# EAGLE schematic packmonitor (EAGLE 7.3.0)
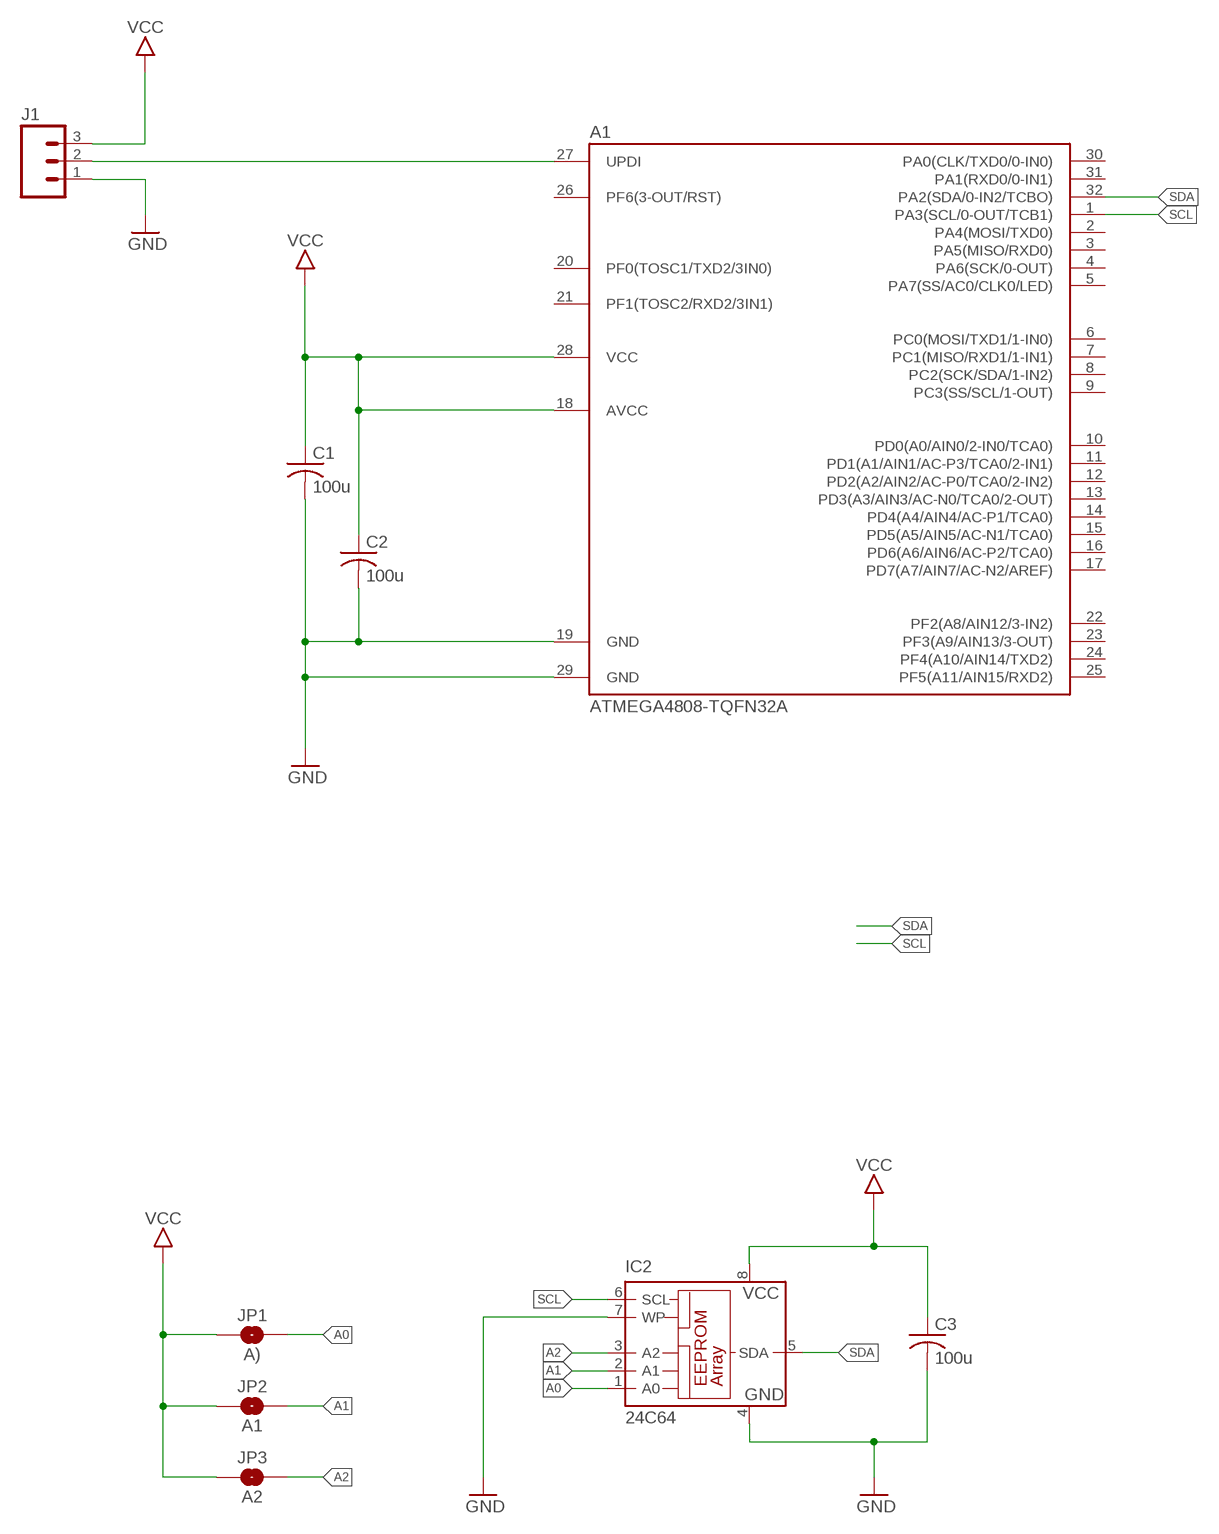
[diagram p0: schematic, sheet 1]

## Parts
A1  ATMEGA4808-TQFN32A  [TQFP32-08]
C1  100u  C-USC0603  [C0603]
C2  100u  C-USC0603  [C0603]
C3  100u  C-USC0603  [C0603]
IC2  24C64  24C04CSN  [SO-08]
J1  M03LOCK_LONGPADS  [1X03_LOCK_LONGPADS]
JP1  A)  JUMPER-SMT_2_NO_SILK  [SMT-JUMPER_2_NO_SILK]
JP2  A1  JUMPER-SMT_2_NO_SILK  [SMT-JUMPER_2_NO_SILK]
JP3  A2  JUMPER-SMT_2_NO_SILK  [SMT-JUMPER_2_NO_SILK]

## Nets
A0: IC2.1(A0) JP1.2
A1: IC2.2(A1) JP2.2
A2: IC2.3(A2) JP3.2
GND: A1.19(GND) A1.29(GND) C1.2 C2.2 C3.2 IC2.4(GND) IC2.7(WP) J1.1
N$2: A1.27(UPDI) J1.2
SCL: A1.1(PA3(SCL/0-OUT/TCB1)) IC2.6(SCL)
SDA: A1.32(PA2(SDA/0-IN2/TCBO)) IC2.5(SDA)
VCC: A1.18(AVCC) A1.28(VCC) C1.1 C2.1 C3.1 IC2.8(VCC) J1.3 JP1.1 JP2.1 JP3.1
Unconnected: A1.2(PA4(MOSI/TXD0)) A1.3(PA5(MISO/RXD0)) A1.4(PA6(SCK/0-OUT)) A1.5(PA7(SS/AC0/CLK0/LED)) A1.6(PC0(MOSI/TXD1/1-IN0)) A1.7(PC1(MISO/RXD1/1-IN1)) A1.8(PC2(SCK/SDA/1-IN2)) A1.9(PC3(SS/SCL/1-OUT)) A1.10(PD0(A0/AIN0/2-IN0/TCA0)) A1.11(PD1(A1/AIN1/AC-P3/TCA0/2-IN1)) A1.12(PD2(A2/AIN2/AC-P0/TCA0/2-IN2)) A1.13(PD3(A3/AIN3/AC-N0/TCA0/2-OUT)) A1.14(PD4(A4/AIN4/AC-P1/TCA0)) A1.15(PD5(A5/AIN5/AC-N1/TCA0)) A1.16(PD6(A6/AIN6/AC-P2/TCA0)) A1.17(PD7(A7/AIN7/AC-N2/AREF)) A1.20(PF0(TOSC1/TXD2/3IN0)) A1.21(PF1(TOSC2/RXD2/3IN1)) A1.22(PF2(A8/AIN12/3-IN2)) A1.23(PF3(A9/AIN13/3-OUT)) A1.24(PF4(A10/AIN14/TXD2)) A1.25(PF5(A11/AIN15/RXD2)) A1.26(PF6(3-OUT/RST)) A1.30(PA0(CLK/TXD0/0-IN0)) A1.31(PA1(RXD0/0-IN1))

## Library data of the parts
A1 = microchip-special:ATMEGA4808-TQFN32
C1-C3 = rcl:C-US: CAPACITOR, American symbol
IC2 = microchip:24C*: Serial EEPROM 1 K/2 K/4 K; OC_FARNELL: unknown; OC_NEWARK: unknown
J1 = SparkFun-Connectors:M03: Header 3 Standard 3-pin 0.1" header. Use with straight break away headers (SKU : PRT-00116), right angle break away headers (PRT-00553), swiss pins (PRT-00743), machine pins (PRT-00117), and female headers (PRT-00115). Molex polarized connector foot print use with SKU : PRT-08232 with associated crimp pins and housings.
JP1-JP3 = SparkFun-Jumpers:JUMPER-SMT_2_NO: Normally open jumper This jumper has two pads in close proximity to each other. Apply solder to close the connection. Round pads are easier to solder for beginners, but are a lot larger. SparkFun Product that uses the round pads: SparkFun EL Sequencer <https://www.sparkfun.com/products/12781>